# Altium schematic sheet Sheet5.SchDoc
size 420 x 297 mm; DocumentNumber: ЭАЕСН.464512.003Э3; SheetNumber: 5; SheetTotal: x; DocumentName: Sheet1.SCHDOC
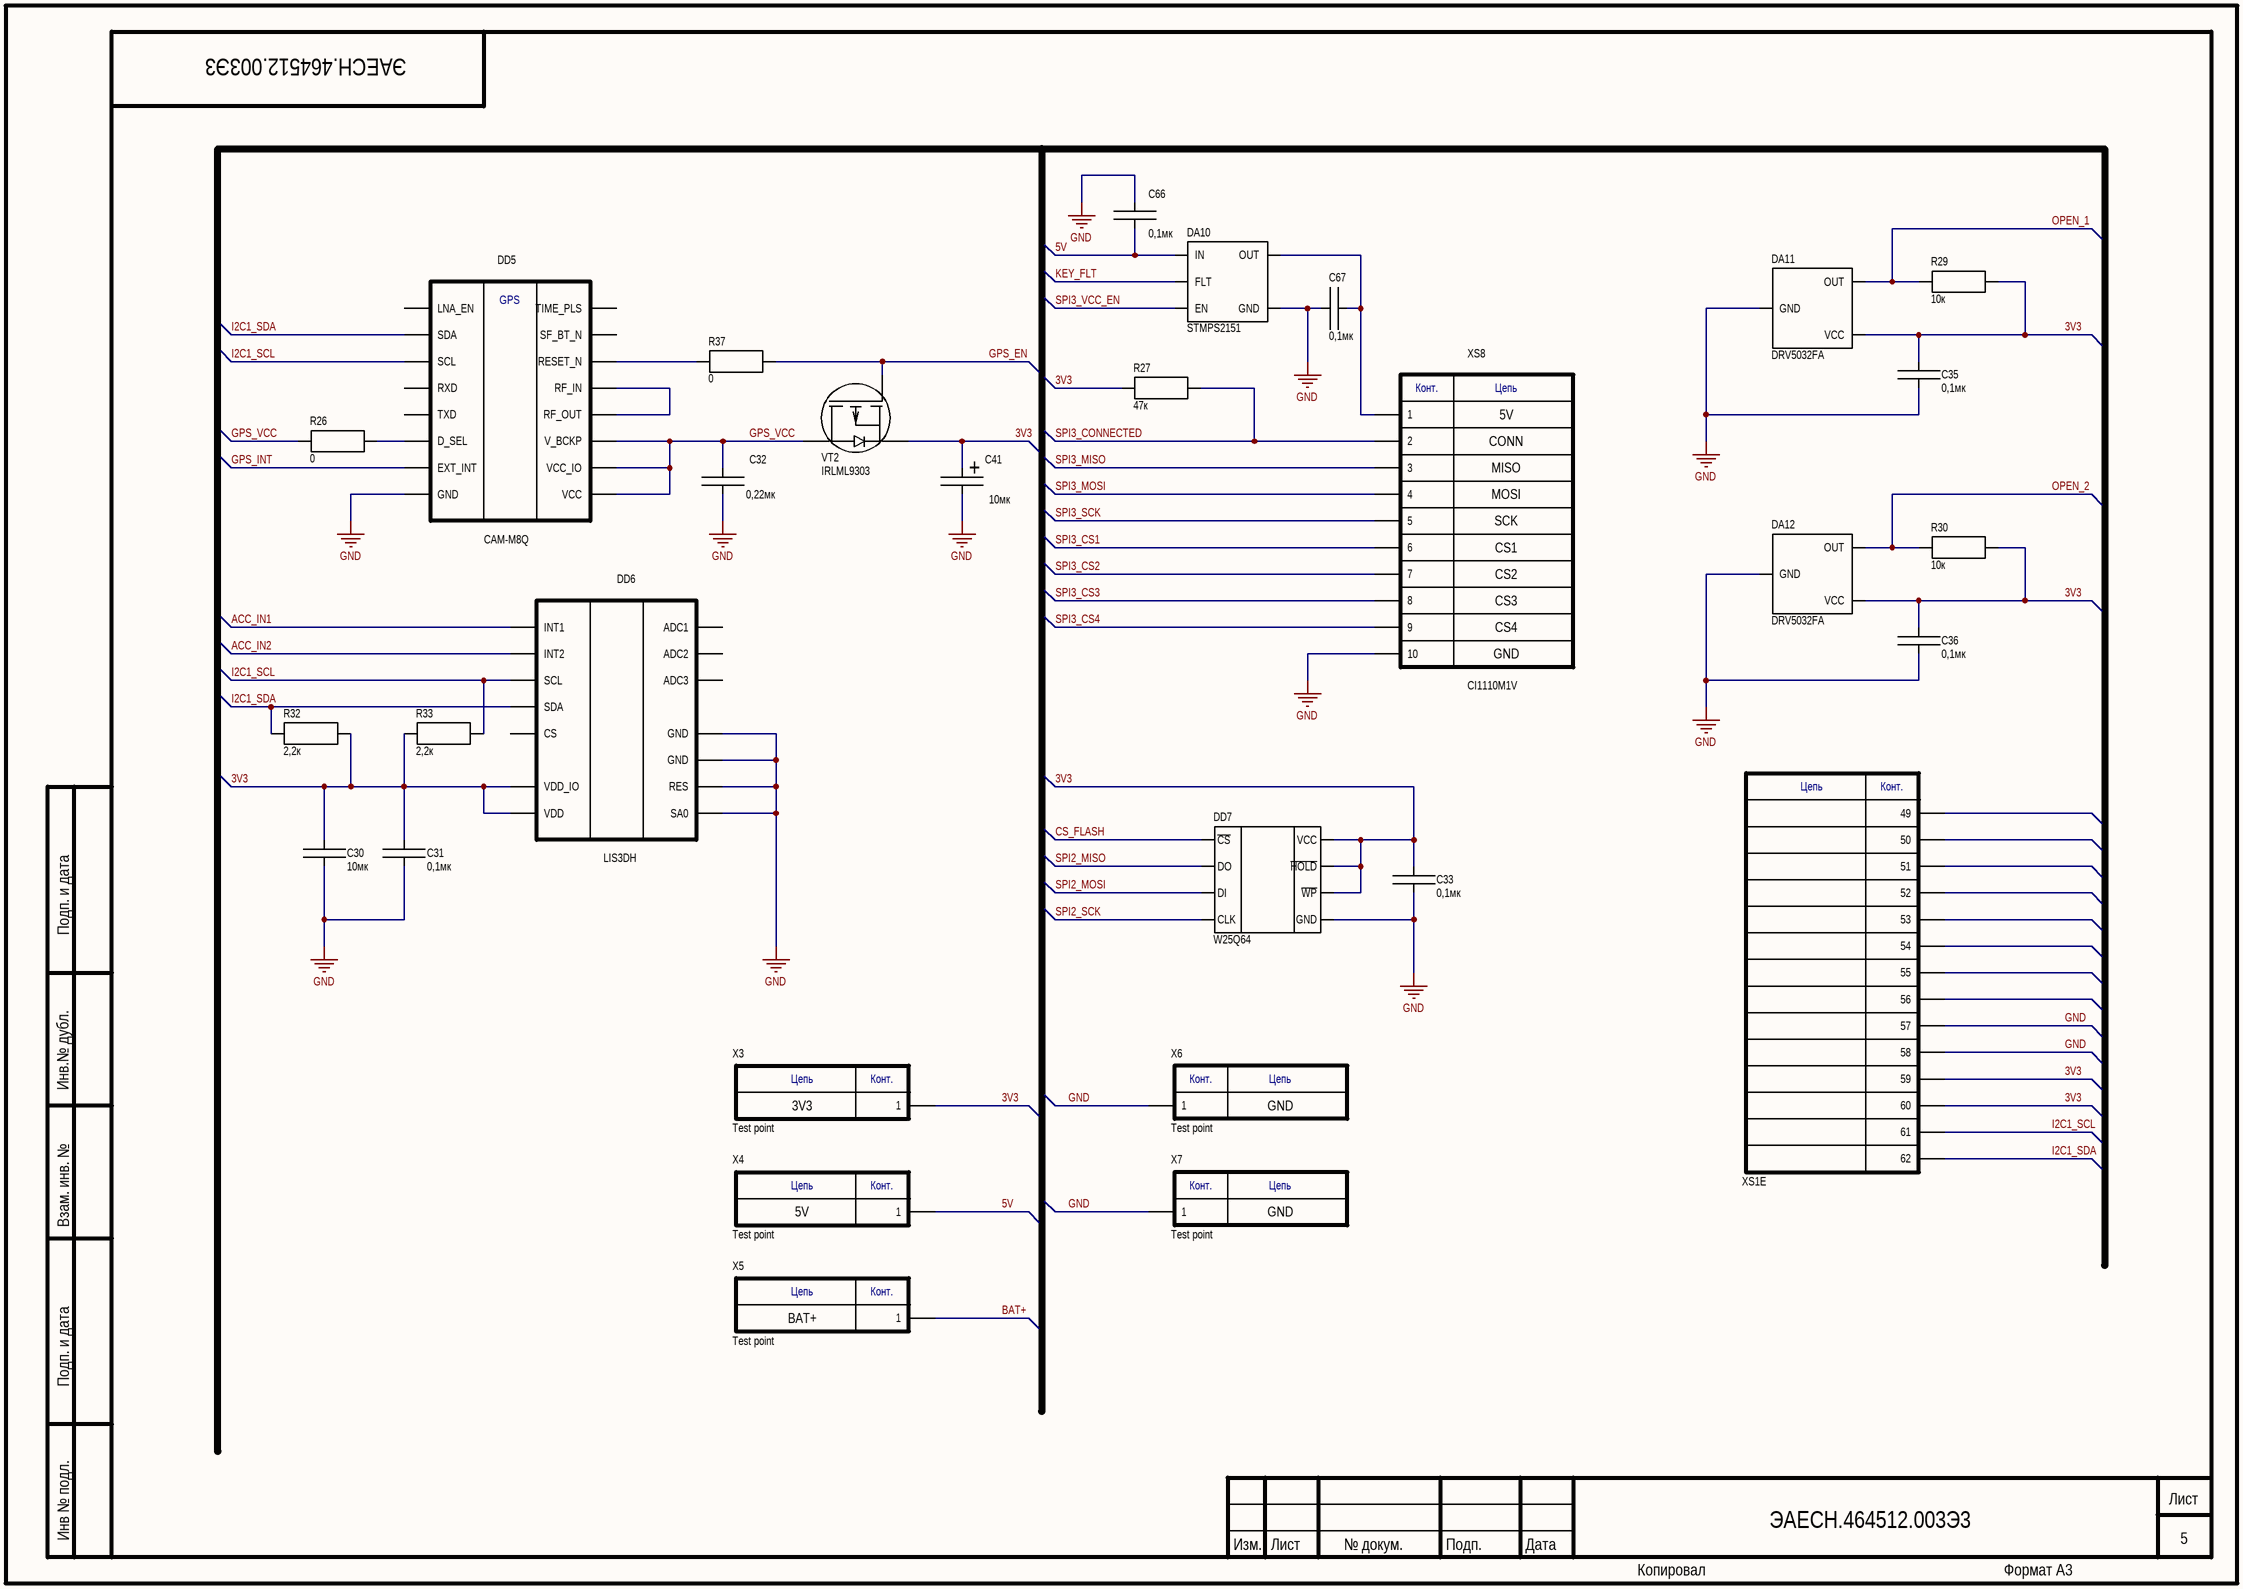
[diagram p0: Sheet5.SchDoc]

## Parts
C30  value 10мк  [С0603]  (hidden comment: C)
C31  value 0,1мк  [С0603]  (hidden comment: C)
C32  value 0,22мк  [С0603]  (hidden comment: C)
C33  value 0,1мк  [С0603]  (hidden comment: C)
C35  value 0,1мк  [С0603]  (hidden comment: C)
C36  value 0,1мк  [С0603]  (hidden comment: C)
C41  value 10мк  [Case A]  (hidden comment: C_el)
C66  value 0,1мк  [С0603]  (hidden comment: C)
C67  value 0,1мк  [С0603]  (hidden comment: C)
DA10  STMPS2151  [SOT-23-5]
DA11  DRV5032FA  [SOT-23]
DA12  DRV5032FA  [SOT-23]
DD5  CAM-M8Q  [CAM-M8Q]
DD6  LIS3DH  [LGA-16]
DD7  W25Q64  [SOIC8_208]
R26  value 0  [R0603]  (hidden comment: R)
R27  value 47к  [R0603]  (hidden comment: R)
R29  value 10к  [R0603]  (hidden comment: R)
R30  value 10к  [R0603]  (hidden comment: R)
R32  value 2,2к  [R0603]  (hidden comment: R)
R33  value 2,2к  [R0603]  (hidden comment: R)
R37  value 0  [R0603]  (hidden comment: R)
VT2  IRLML9303  [SOT-23]
X3  Test point  [Test_point]
X4  Test point  [Test_point]
X5  Test point  [Test_point]
X6  Test point  [Test_point]
X7  Test point  [Test_point]
XS1  M.2  [M.2]  (value not drawn)  (part E of 5)
XS8  СI1110М1V  [СI1110М1V]

## Nets
GND: C30.2 C31.2 C32.2 C33.2 C35.2 C36.2 C41.2 C66.1 C67.1 DA10.2(GND) DA11.3(GND) DA12.3(GND) DD5.4(GND) DD5.5(GND) DD5.10(GND) DD5.11(GND) DD5.12(GND) DD5.13(GND) DD5.14(GND) DD5.15(GND) DD5.18(GND) DD5.19(GND) DD5.21(GND) DD5.22(GND) DD5.27(GND) DD5.31(GND) DD6.5(GND) DD6.7(SA0) DD6.10(RES) DD6.12(GND) DD7.4(GND) X6.1 X7.1 XS1.57 XS1.58 XS8.10
3V3: C30.1 C31.1 C33.1 C35.1 C36.1 C41.1 DA11.1(VCC) DA12.1(VCC) DD6.1(VDD_IO) DD6.14(VDD) DD7.3(~{WP}) DD7.7(~{HOLD}) DD7.8(VCC) R27.1 R29.2 R30.2 R32.2 R33.1 VT2.2(S) X3.1 XS1.59 XS1.60
5V: C66.2 DA10.5(IN) X4.1
ACC_IN1: DD6.11(INT1)
ACC_IN2: DD6.9(INT2)
BAT+: X5.1
CS_FLASH: DD7.1(~{CS})
GPS_EN: R37.2 VT2.1(G)
GPS_INT: DD5.7(EXT_INT)
GPS_VCC: C32.1 DD5.1(VCC_IO) DD5.8(V_BCKP) DD5.9(VCC) R26.2 VT2.3(D)
I2C1_SCL: DD5.6(SCL) DD6.4(SCL) R33.2 XS1.61
I2C1_SDA: DD5.3(SDA) DD6.6(SDA) R32.1 XS1.62
KEY_FLT: DA10.3(FLT)
OPEN_1: DA11.2(OUT) R29.1
OPEN_2: DA12.2(OUT) R30.1
SPI2_MISO: DD7.2(DO)
SPI2_MOSI: DD7.5(DI)
SPI2_SCK: DD7.6(CLK)
SPI3_CONNECTED: R27.2 XS8.2
SPI3_CS1: XS8.6
SPI3_CS2: XS8.7
SPI3_CS3: XS8.8
SPI3_CS4: XS8.9
SPI3_MISO: XS8.3
SPI3_MOSI: XS8.4
SPI3_SCK: XS8.5
SPI3_VCC_EN: DA10.4(EN)
NetC67_2: C67.2 DA10.1(OUT) XS8.1
NetDD5_16: DD5.16(RF_OUT) DD5.17(RF_IN)
NetDD5_20: DD5.20(D_SEL) R26.1
NetDD5_23: DD5.23(RESET_N) R37.1

Not connected (* = marked no-connect by the designer): DD5 24(SF_BT_N) 25(TXD) 26(RXD) 29(TIME_PLS) 30(LNA_EN); DD6 8(CS) 13(ADC3) 15(ADC2) 16(ADC1); XS1 49 50 51 52 53 54 55 56

## Notes on the sheet
- 5V
- CONN
- MISO
- MOSI
- SCK
- CS1
- CS2
- CS3
- CS4
- GND
- 3V3
- BAT+
- Подп. и дата
- Инв.№ дубл.
- Взам. инв. №
- Инв № подл.
- Изм.
- Лист
- № докум.
- Подп.
- Дата
- Копировал
- Формат А3
- (in symbol 10pin) Конт.; Цепь
- (in symbol C_el) +
- (in symbol M.2, part E) Цепь; Конт.
- (in symbol Test_point) Конт.; Цепь

## Library data of the parts
DA10 = STMPS21x1
DA11 DA12 = DRV5032
DD5 = CAM-M8Q: GPS
DD6 = LIS3DH: Accelerometr
DD7 = W25Q64: RAM
VT2 = P-channel
X3-X7 = Test_point
XS8 = 10pin